# Altium schematic sheet RP2040.SchDoc
size A3; SheetNumber: 2; SheetTotal: 4
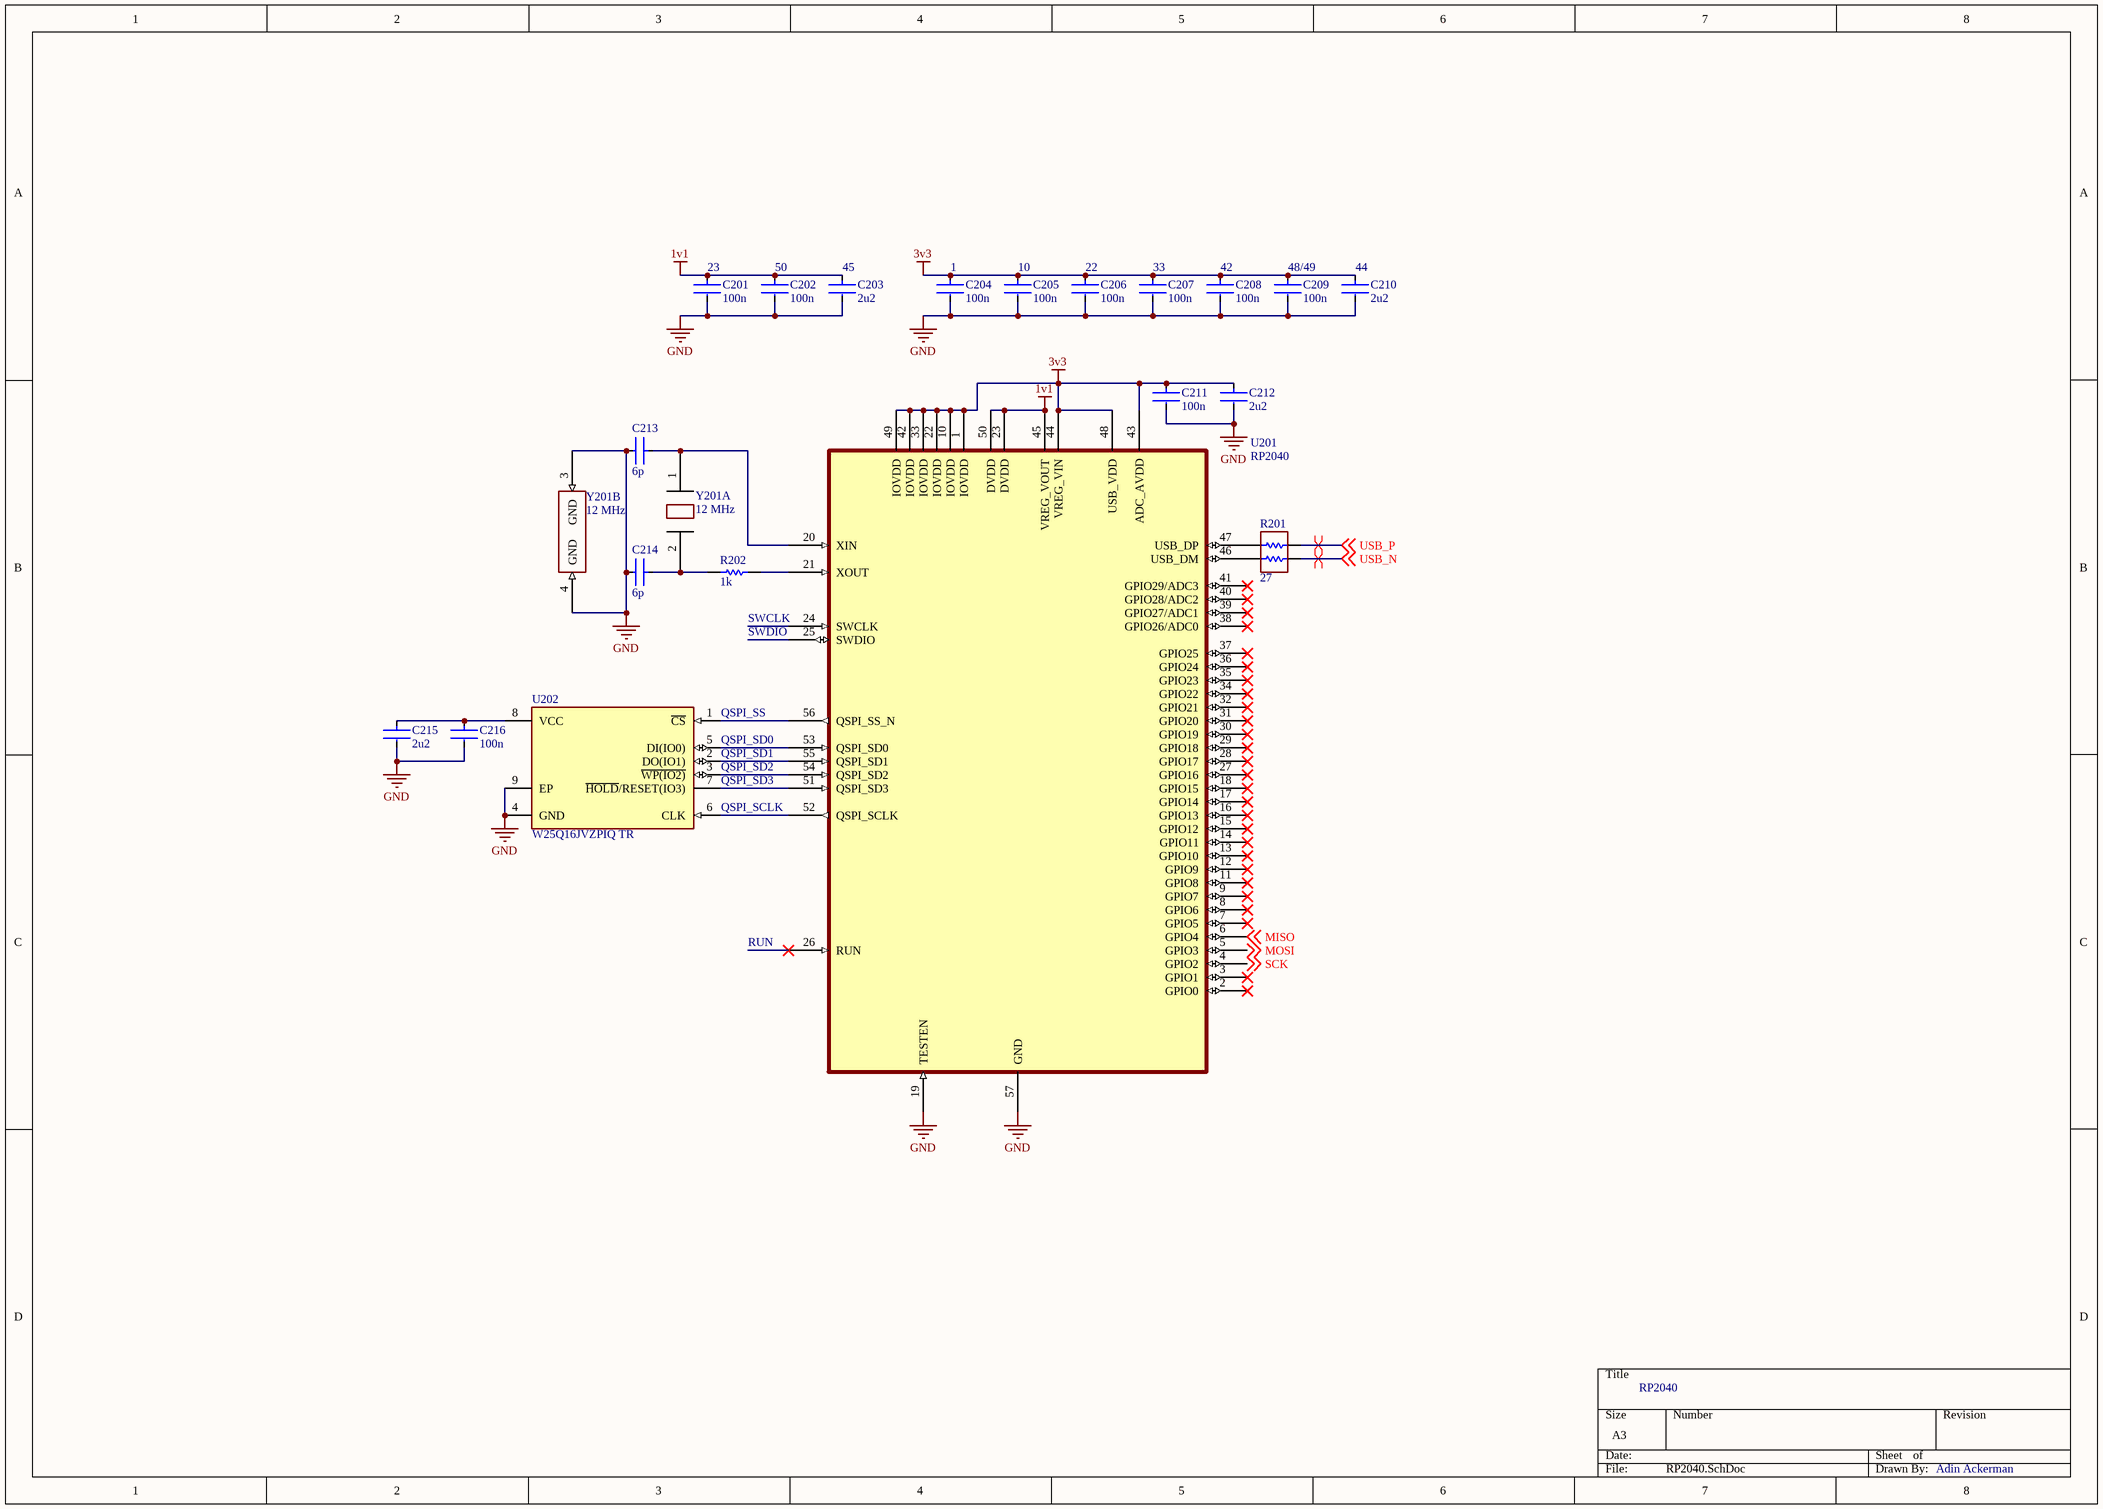
[diagram p0: RP2040.SchDoc]

## Parts
C201  100n  [FP-GCM155-0_05-MFG]
C202  100n  [FP-GCM155-0_05-MFG]
C203  2u2  [CAPC1608X10N]
C204  100n  [FP-GCM155-0_05-MFG]
C205  100n  [FP-GCM155-0_05-MFG]
C206  100n  [FP-GCM155-0_05-MFG]
C207  100n  [FP-GCM155-0_05-MFG]
C208  100n  [FP-GCM155-0_05-MFG]
C209  100n  [FP-GCM155-0_05-MFG]
C210  2u2  [CAPC1608X10N]
C211  100n  [FP-GCM155-0_05-MFG]
C212  2u2  [CAPC1608X10N]
C213  6p  [FP-GCQ155-0_05-MFG]
C214  6p  [FP-GCQ155-0_05-MFG]
C215  2u2  [CAPC1608X10N]
C216  100n  [FP-GCM155-0_05-MFG]
R201  27  [CAC-65P100X100-4L]
R202  1k  [RESC1005X04N]
U201  RP2040  [QFN40P700X700X90_HS-57N]
U202  W25Q16JVZPIQ TR  [WSON-8]
Y201  12 MHz  (parts A,B of 2)

## Nets
1v1: C201.1 C202.1 C203.1 U201.23(DVDD) U201.45(VREG_VOUT) U201.50(DVDD)
3v3: C204.1 C205.1 C206.1 C207.1 C208.1 C209.1 C210.1 C211.1 C212.1 U201.1(IOVDD) U201.10(IOVDD) U201.22(IOVDD) U201.33(IOVDD) U201.42(IOVDD) U201.43(ADC_AVDD) U201.44(VREG_VIN) U201.48(USB_VDD) U201.49(IOVDD)
GND: C201.2 C202.2 C203.2 C204.2 C205.2 C206.2 C207.2 C208.2 C209.2 C210.2 C211.2 C212.2 C213.2 C214.2 C215.2 C216.2 U201.19(TESTEN) U201.57(GND) U202.4(GND) U202.9(EP) Y201.3(GND) Y201.4(GND)
MISO: U201.6(GPIO4) ; off-sheet MISO
MOSI: U201.5(GPIO3) ; off-sheet MOSI
SCK: U201.4(GPIO2) ; off-sheet SCK
USB_N: R201.3 ; off-sheet USB_N
USB_P: R201.4 ; off-sheet USB_P
NetC213_1: C213.1 U201.20(XIN) Y201.1
NetC214_1: C214.1 R202.1 Y201.2
NetC215_1: C215.1 C216.1 U202.8(VCC)
NetR201_1: R201.1 U201.47(USB_DP)
NetR201_2: R201.2 U201.46(USB_DM)
NetR202_2: R202.2 U201.21(XOUT)
NetU201_51: U201.51(QSPI_SD3) U202.7(~{HOLD}/RESET(IO3))
NetU201_52: U201.52(QSPI_SCLK) U202.6(CLK)
NetU201_53: U201.53(QSPI_SD0) U202.5(DI(IO0))
NetU201_54: U201.54(QSPI_SD2) U202.3(~{WP(IO2)})
NetU201_55: U201.55(QSPI_SD1) U202.2(DO(IO1))
NetU201_56: U201.56(QSPI_SS_N) U202.1(~{CS})

Not connected (* = marked no-connect by the designer): U201 2(GPIO0)* 3(GPIO1)* 7(GPIO5)* 8(GPIO6)* 9(GPIO7)* 11(GPIO8)* 12(GPIO9)* 13(GPIO10)* 14(GPIO11)* 15(GPIO12)* 16(GPIO13)* 17(GPIO14)* 18(GPIO15)* 24(SWCLK) 25(SWDIO) 26(RUN)* 27(GPIO16)* 28(GPIO17)* 29(GPIO18)* 30(GPIO19)* 31(GPIO20)* 32(GPIO21)* 34(GPIO22)* 35(GPIO23)* 36(GPIO24)* 37(GPIO25)* 38(GPIO26/ADC0)* 39(GPIO27/ADC1)* 40(GPIO28/ADC2)* 41(GPIO29/ADC3)*

## Layout directives
differential pair: USB_N, USB_P

## Notes on the sheet
- (near C201) 23
- (near C202) 50
- (near C203) 45
- (near C204) 1
- (near C205) 10
- (near C206) 22
- (near C207) 33
- (near C208) 42
- (near C209) 48/49
- (near C210) 44
- SWCLK
- SWDIO
- (near U202) QSPI_SS
- (near U202) QSPI_SD0
- (near U202) QSPI_SD1
- (near U202) QSPI_SD2
- (near U202) QSPI_SD3
- (near U202) QSPI_SCLK
- RUN
- RP2040
- Adin Ackerman

## Library data of the parts
C201 C202 C204-C209 C211 C216 = GCM155R71H104KE02J: Ceramic Capacitor for Automotive 100nF ±10% 50VDC X7R 0402 Paper T/R; Voltage Rating (DC): 50V; Case Code (Metric): 1005; Dielectric: X7R; Capacitance: 100nF; Packaging: Tape and Reel; Min Operating Temperature: -55°C; Length: 0.039inch; Thickness: 0.022inch; Height: 0.5mm; Mount: Surface Mount; Termination: SMD/SMT; Voltage Rating: 50V; Package Quantity: 50000; Width: 0.02inch; Case/Package: 0402; Case Code (Imperial): 0402; Ratings: AEC-Q200; Max Operating Temperature: 125°C; Tolerance: 10%; Weight: 0.000212oz; Supplier 1: Digi-Key; Supplier Part Number 1: 490-14514-1-ND
C203 C210 C212 C215 = GRT188R61H225ME13D: Multilayer Ceramic Capacitors MLCC - SMD/SMT 0603 50Vdc 2.2uF X5R 20%; Supplier 1: Future Electronics; Supplier Part Number 1: 5087209
C213 C214 = GCQ1555C1H6R0BB01D: High Q Ceramic Capacitor for Automotive 6pF ±0.1pF 50VDC C0G 0402 Paper T/R; Voltage Rating: 50V; Max Operating Temperature: 125°C; Capacitance: 6pF; Case Code (Imperial): 0402; Min Operating Temperature: -55°C; Case/Package: 0402; Mount: Surface Mount; Case Code (Metric): 1005; Ratings: AEC-Q200; Packaging: Tape and Reel; Supplier 1: Digi-Key; Supplier Part Number 1: 490-17493-1-ND
R201 = EXB-24V270JX: Supplier 1: Digi-Key; Supplier Part Number 1: Y5270CT-ND
R202 = ERJ-2GEJ102X: Manufacturer: Panasonic; Part Number: ERJ-2GEJ102X; Supplier 1: Newark; Supplier Part Number 1: 65T8247
U202 = W25Q16JVZPIQ TR: IC FLASH 16M SPI 133MHZ 8WSON; Memory Type: Non-Volatile; Memory Size: 16Mb; Max Operating Temperature: 85°C; Min Operating Temperature: -40°C; Frequency: 133MHz; Mount: Surface Mount; Packaging: Tape and Reel; Supplier 1: Digi-Key; Supplier Part Number 1: W25Q16JVZPIQCT-ND
Y201 = ABM10-166-12.000MHZ-T3: Supplier 1: Newark; Supplier Part Number 1: 51AC8104
U201 = RP2040: Supplier 1: Newark; Supplier Part Number 1: 49AJ8739